# EAGLE design arduino_Shield_ABZ_Decoder_V01 (EAGLE 6.6.0)
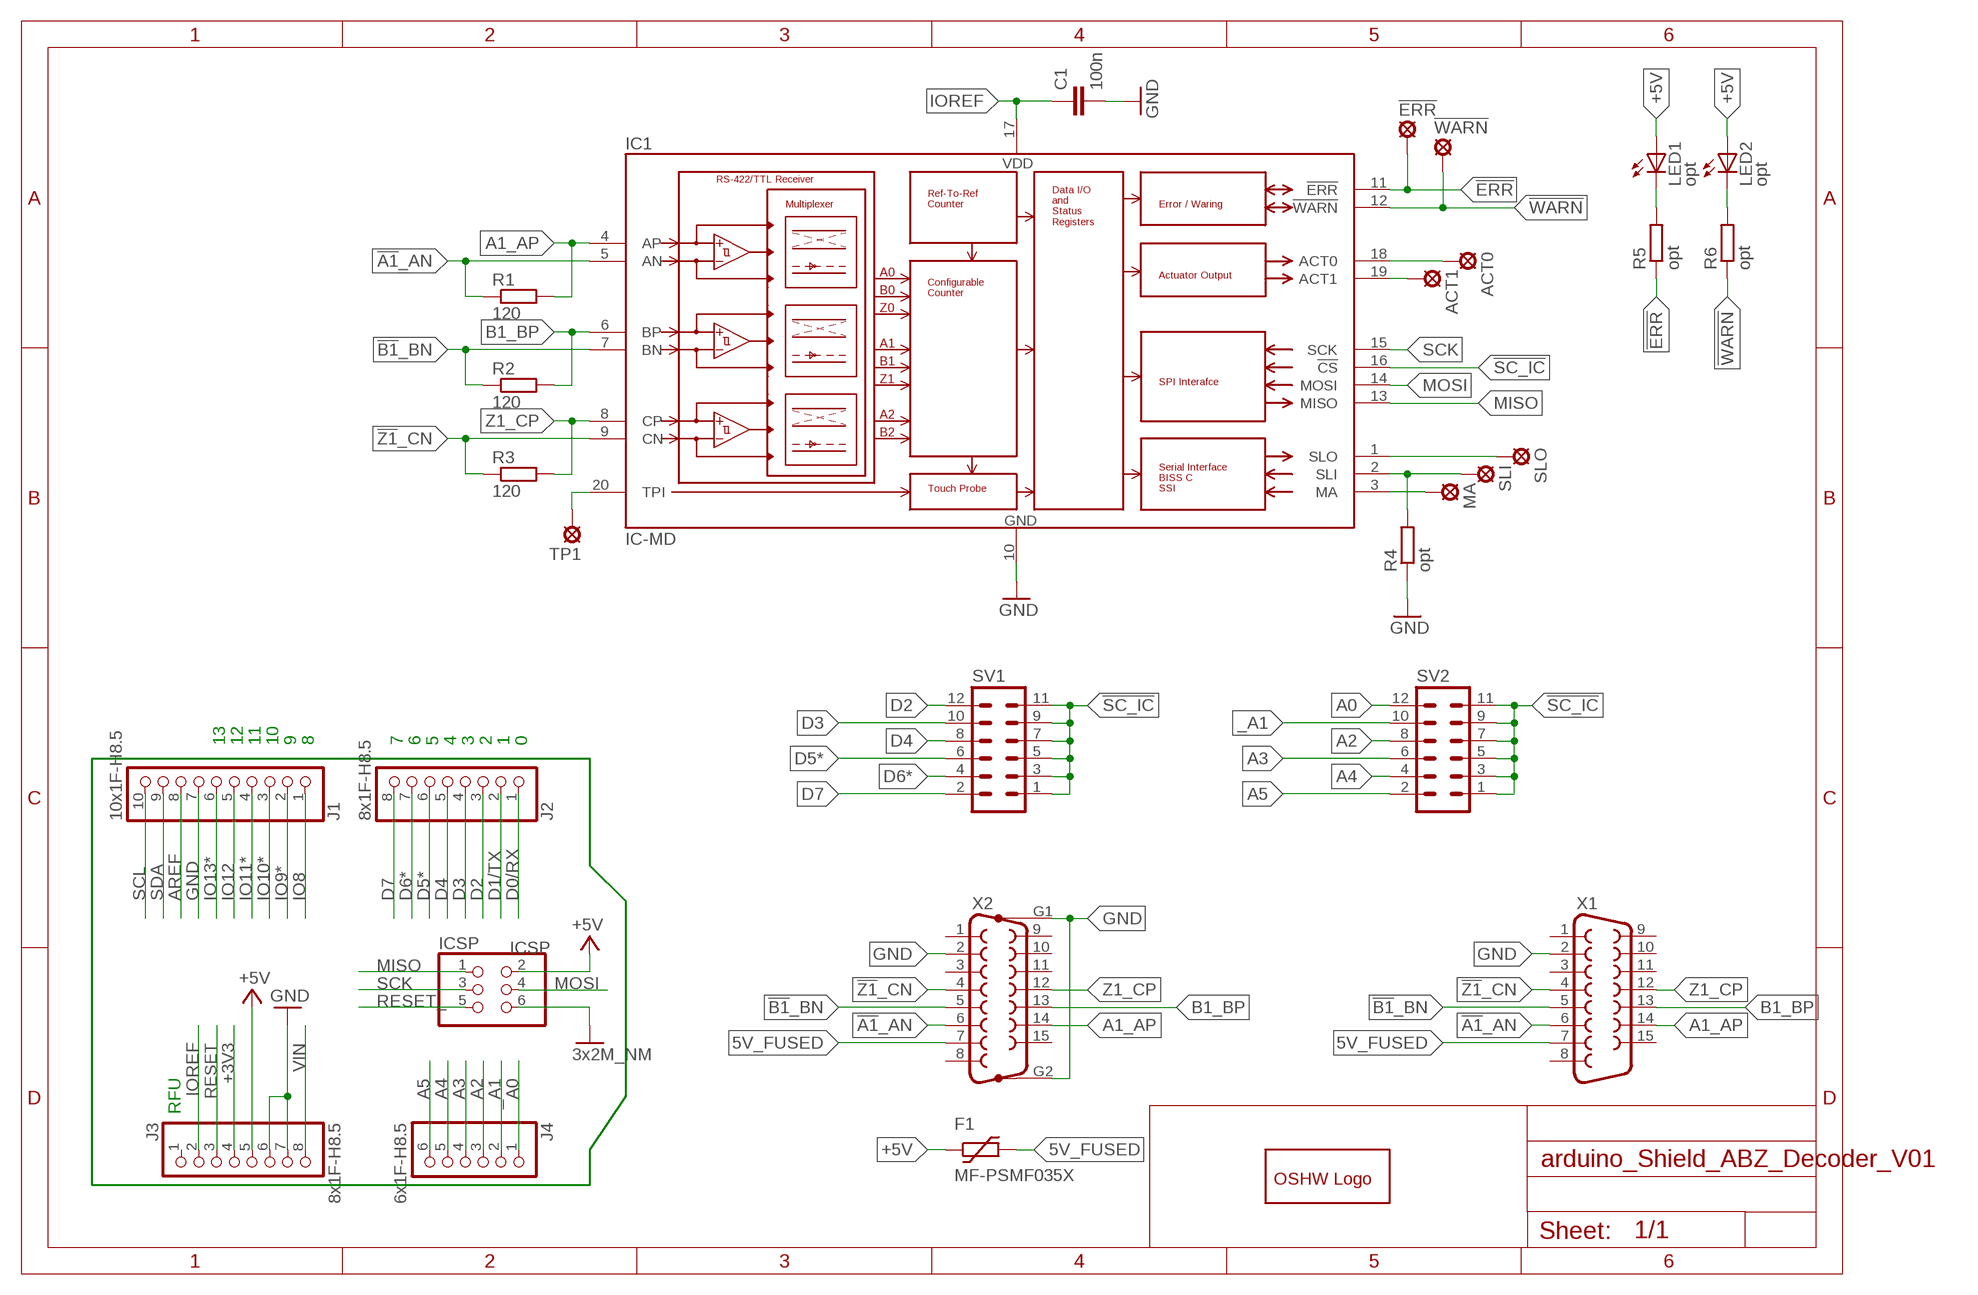
[diagram p0: schematic, sheet 1]

## Parts
!ERR  LSP10  [LSP10]
!WARN  LSP10  [LSP10]
ACT0  LSP10  [LSP10]
ACT1  LSP10  [LSP10]
C1  100n  C-EUC0805  [C0805]
F1  MF-PSMF035X  [F0805]
GOLD_ORB_SM1  OSHWLOGOLOGO8MM  [OSHW_8MM]
IC1  IC-MD  [TSSOP20]
ICSP  ICSP  PINHD-2X3  [2X03]
J1  10x1F-H8.5  PINHD-1X10  [1X10]
J2  8x1F-H8.5  PINHD-1X8  [1X08]
J3  8x1F-H8.5  PINHD-1X8  [1X08]
J4  6x1F-H8.5  PINHD-1X6  [1X06]
LED1  opt  LED3MM  [LED3MM]
LED2  opt  LED3MM  [LED3MM]
MA  LSP10  [LSP10]
R1  120  R-EU_M1206  [M1206]
R2  120  R-EU_M1206  [M1206]
R3  120  R-EU_M1206  [M1206]
R4  opt  R-EU_M1206  [M1206]
R5  opt  R-EU_M1206  [M1206]
R6  opt  R-EU_M1206  [M1206]
SLI  LSP10  [LSP10]
SLO  LSP10  [LSP10]
SV1  MA06-2  [MA06-2]
SV2  MA06-2  [MA06-2]
TP1  LSP10  [LSP10]
X1  F15D  [F15D]
X2  F15HP  [F15HP]

## Nets
5V_FUSED: F1.2 X1.7 X2.7
!A1!_AN: IC1.5(AN) R1.1 X1.6 X2.6
!B1!_BN: IC1.7(BN) R2.1 X1.5 X2.5
!ERR: !ERR.MP IC1.11(!ERR) R5.1
!SC_IC: IC1.16(!CS) SV1.1 SV1.3 SV1.5 SV1.7 SV1.9 SV1.11 SV2.1 SV2.3 SV2.5 SV2.7 SV2.9 SV2.11
!WARN: !WARN.MP IC1.12(!WARN) R6.1
!Z1!_CN: IC1.9(CN) R3.1 X1.4 X2.4
+3V3: J3.4
+5V [usbvcc]: F1.1 ICSP.2 J3.5 LED1.A LED2.A
_A1: J4.2 SV2.10
A0: J4.1 SV2.12
A1_AP: IC1.4(AP) R1.2 X1.14 X2.14
A2: J4.3 SV2.8
A3: J4.4 SV2.6
A4: J4.5 SV2.4
A5: J4.6 SV2.2
ACT0: ACT0.MP IC1.18(ACT0)
ACT1: ACT1.MP IC1.19(ACT1)
AREF [aref]: J1.8
B1_BP: IC1.6(BP) R2.2 X1.13 X2.13
D0/RX: J2.1
D1/TX: J2.2
D2: J2.3 SV1.12
D3: J2.4 SV1.10
D4: J2.5 SV1.8
D5*: J2.6 SV1.6
D6*: J2.7 SV1.4
D7: J2.8 SV1.2
GND [gnd]: C1.2 IC1.10(GND) ICSP.6 J1.7 J3.6 J3.7 R4.1 X1.2 X2.2 X2.G1 X2.G2 ; supply symbol labelled 3x2M_NM
IO8: J1.1
IO9*: J1.2
IO10*: J1.3
IO11*: J1.4
IO12: J1.5
IO13*: J1.6
IOREF [usbvcc]: C1.1 IC1.17(VDD) J3.2
MA [gnd]: IC1.3(MA) MA.MP
MISO: IC1.13(MISO) ICSP.1
MOSI: IC1.14(MOSI) ICSP.4
N$14: LED1.K(C) R5.2
N$15: LED2.K(C) R6.2
RESET: J3.3
RESET_: ICSP.5
SCK: IC1.15(SCK) ICSP.3
SCL: J1.10
SDA: J1.9
SLI [gnd]: IC1.2(SLI) R4.2 SLI.MP
SLO: IC1.1(SLO) SLO.MP
TP1: IC1.20(TPI) TP1.MP
VIN [power]: J3.8
Z1_CP: IC1.8(CP) R3.2 X1.12 X2.12
Unconnected: J3.1 X1.1 X1.3 X1.8 X1.9 X1.10 X1.11 X1.15 X2.1 X2.3 X2.8 X2.9 X2.10 X2.11 X2.15

## Notes on the sheet
- 13 | 12 | 11 | 10 | 9 | 8 | 7 | 6 | 5 | 4 | 3 | 2 | 1 | 0
- RFU

## Library data of the parts
!ERR !WARN ACT0 ACT1 MA SLI SLO TP1 = solpad:LSP10: SOLDER PAD drill 1.0 mm, distributor Buerklin, 12H555
C1 = rcl:C-EU: CAPACITOR, European symbol
F1 = Fuses:MF-PSMF*X: BOURNS MF-PSMF???X-2 MULTISICHERUNG, SMD, 0805; I_HOLD: 0,35A; I_TRIP: 0,75A; MANUFACTOR: Bourns; MPN: MF-PSMF035X; OC_FARNELL: 1294875; OPERATING_TEMPERATURE: -40 °C to +85 °C; PART_IDENTIFICATION: 3; V_MAX: 6V
GOLD_ORB_SM1 = oshw:OSHWLOGO: The OSHW logo for PCB layout
IC1 = IC-MD:IC-MD: iC-MD 48-Bit Quadrature Counter with RS422 Receiver and SPI/BiSS Interface Counter resolutions: 16, 24, 32 and 48 bit Up to 3 AB/ABZ quadrature counters configurable High count frequency of up to 40 MHz Pin triggered touch probe function Evaluation of distance-coded reference marks Cascading/bus capable via SPI and BiSS C Interface RS422, TTL, CMOS, LVDS input signals Operating temperature -40 °C to +125 °C, small TSSOP package 1 Channel 16, 24, 32 or 48 bit counting for quadrature signals with index (TTL, diff. RS422 or LVDS) Default: 1x A/B/Z, RS422, 24 bit 2 Channel 16/24 bit, or 16/32 bit counting (2x single-ended TTL with index: A/B/Z) 3 Channel 16 bit counting (3x single-ended TTL: A/B) Two actuator output signals Operation from 3.3 V to 5 V Homepage: http://ichaus.de/MD Datenblatt: http://ichaus.de/MD_datasheet_en; MANUFACTURER: IC-Haus; MPN: iC-MD TSSOP20; OC_ICHAUS: iC-MD TSSOP20
ICSP = SmartPrj:PINHD-2X3: PIN HEADER
J1 = SmartPrj:PINHD-1X10: PIN HEADER
J2 J3 = SmartPrj:PINHD-1X8: PIN HEADER
J4 = SmartPrj:PINHD-1X6: PIN HEADER
LED1 LED2 = led:LED: LED OSRAM: - CHIPLED LG R971, LG N971, LY N971, LG Q971, LY Q971, LO R971, LY R971 LH N974, LH R974 LS Q976, LO Q976, LY Q976 LO Q996 - Hyper CHIPLED LW Q18S LB Q993, LB Q99A, LB R99A - SideLED LS A670, LO A670, LY A670, LG A670, LP A670 LB A673, LV A673, LT A673, LW A673 LH A674 LY A675 LS A676, LA A676, LO A676, LY A676, LW A676 LS A679, LY A679, LG A679 - Hyper Micro SIDELED® LS Y876, LA Y876, LO Y876, LY Y876 LT Y87S - SmartLED LW L88C, LW L88S LB L89C, LB L89S, LG L890 LS L89K, LO L89K, LY L89K LS L896, LA L896, LO L896, LY L896 - TOPLED LS T670, LO T670, LY T670, LG T670, LP T670 LSG T670, LSP T670, LSY T670, LOP T670, LYG T670 LG T671, LOG T671, LSG T671 LB T673, LV T673, LT T673, LW T673 LH T674 LS T676, LA T676, LO T676, LY T676, LB T676, LH T676, LSB T676, LW T676 LB T67C, LV T67C, LT T67C, LS T67K, LO T67K, LY T67K, LW E67C LS E67B, LA E67B, LO E67B, LY E67B, LB E67C, LV E67C, LT E67C LW T67C LS T679, LY T679, LG T679 LS T770, LO T770, LY T770, LG T770, LP T770 LB T773, LV T773, LT T773, LW T773 LH T774 LS E675, LA E675, LY E675, LS T675 LS T776, LA T776, LO T776, LY T776, LB T776 LHGB T686 LT T68C, LB T68C - Hyper Mini TOPLED® LB M676 - Mini TOPLED Santana® LG M470 LS M47K, LO M47K, LY M47K Source: http://www.osram.convergy.de LUXEON: - LUMILED® LXK2-PW12-R00, LXK2-PW12-S00, LXK2-PW14-U00, LXK2-PW14-V00 LXK2-PM12-R00, LXK2-PM12-S00, LXK2-PM14-U00 LXK2-PE12-Q00, LXK2-PE12-R00, LXK2-PE12-S00, LXK2-PE14-T00, LXK2-PE14-U00 LXK2-PB12-K00, LXK2-PB12-L00, LXK2-PB12-M00, LXK2-PB14-N00, LXK2-PB14-P00, LXK2-PB14-Q00 LXK2-PR12-L00, LXK2-PR12-M00, LXK2-PR14-Q00, LXK2-PR14-R00 LXK2-PD12-Q00, LXK2-PD12-R00, LXK2-PD12-S00 LXK2-PH12-R00, LXK2-PH12-S00 LXK2-PL12-P00, LXK2-PL12-Q00, LXK2-PL12-R00 Source: www.luxeon.com KINGBRIGHT: KA-3528ASYC Source: www.kingbright.com
R1-R6 = rcl:R-EU_: RESISTOR, European symbol
SV1 SV2 = con-lstb:MA06-2: PIN HEADER; OC_FARNELL: unknown; OC_NEWARK: unknown
X1 = con-subd:F15: SUB-D; OC_FARNELL: unknown; OC_NEWARK: unknown
X2 = con-subd:F15HP: SUB-D; OC_FARNELL: unknown; OC_NEWARK: unknown

## Net classes
0 default: width 0.254 mm, drill 0.61 mm, clearance 0.254 mm
1 power: width 0.254 mm, drill 0.61 mm, clearance 0.254 mm
2 gnd: width 0.254 mm, drill 0.61 mm, clearance 0.254 mm
3 usbvcc: width 0.254 mm, drill 0.61 mm, clearance 0.254 mm
4 aref: width 0.254 mm, drill 0.61 mm, clearance 0.254 mm

## Board
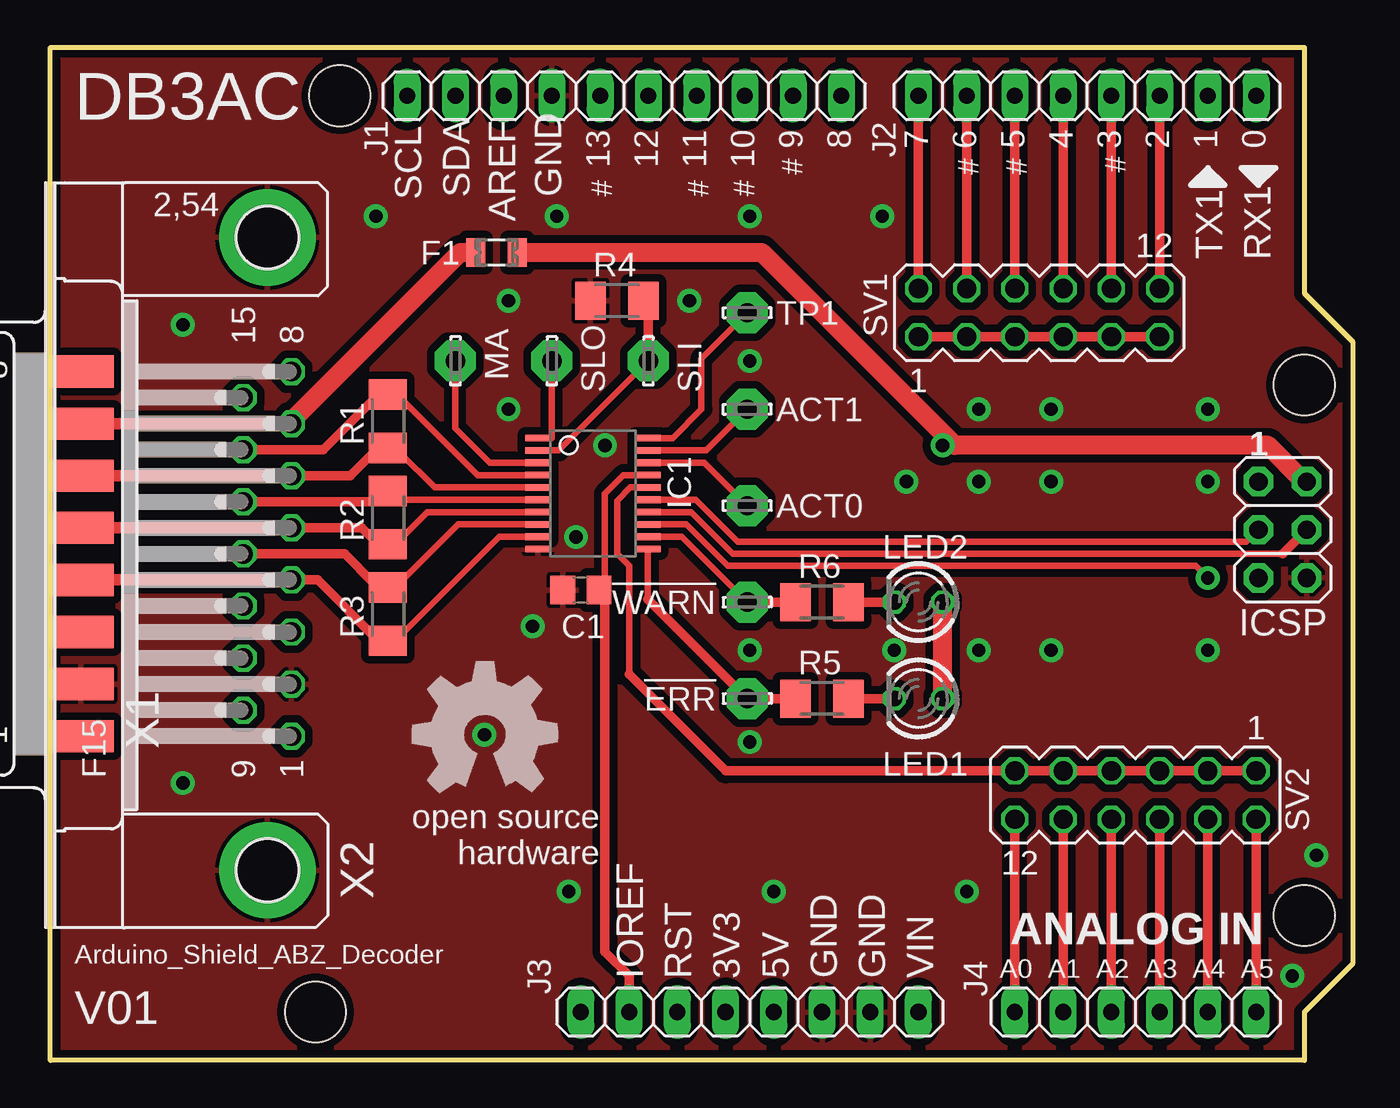
[diagram p1: board, top side]
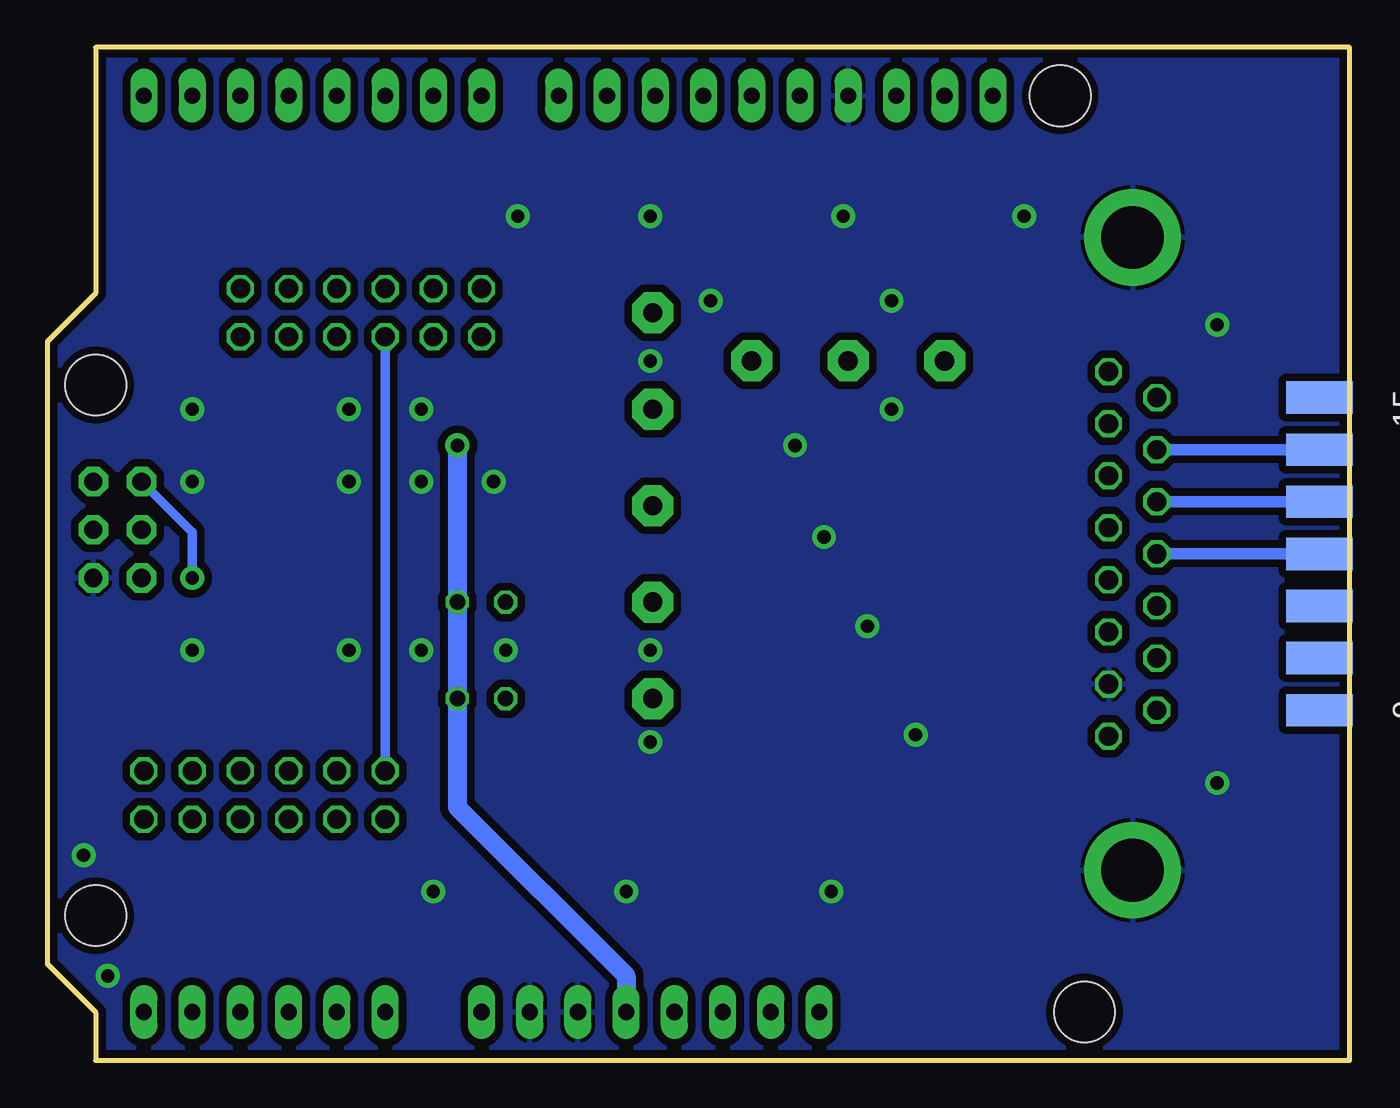
[diagram p2: board, bottom side, seen from below]

Size 68.58 x 53.34 mm. Coordinates in mm from the lower left corner, seen from the top.
Outline: 0,53.34 66.04,53.34 66.04,40.39 68.58,37.85 68.58,5.08 66.04,2.54 66.04,0 0,0 0,53.34
Copper layers (1*16): Top 0.035mm / dielectric 1.5mm / Bottom 0.035mm
Design rules "PCB-POOL Standard": minimum track width 0.15mm, minimum drill 0.3mm, track to track 0.15mm, track to pad 0.15mm, pad to pad 0.15mm, via to via 0.15mm, smd to smd 0.15mm, copper to edge 0.3mm, drill to drill 0.2mm, minimum pad ring 0.2mm, minimum via ring 0.15mm, stop-mask expansion 0.075mm, vias tented up to drill 0mil, thermal gap 0.2mm
Holes 3.2 mm at 66.04,35.56 66.04,7.62 15.24,50.8 13.97,2.54

### Footprints (pad centres in the part's own frame; a part is rotated, then mirrored left to right if it is on the bottom)
LSP10 = drill 1.016 pad 2.159 octagon: MP 0,0
C0805 = smd 1.3 x 1.5: 1 -0.95,0; 2 0.95,0
F0805 = smd 1 x 1.5: 1 -1.1,0; 2 1.1,0
TSSOP20 = smd 0.35 x 1.35: 1 -2.925,-2.9; 2 -2.275,-2.9; 3 -1.625,-2.9; 4 -0.975,-2.9; 5 -0.325,-2.9; 6 0.325,-2.9; 7 0.975,-2.9; 8 1.625,-2.9; 9 2.275,-2.9; 10 2.925,-2.9; 11 2.925,2.9; 12 2.275,2.9; 13 1.625,2.9; 14 0.975,2.9; 15 0.325,2.9; 16 -0.325,2.9; 17 -0.975,2.9; 18 -1.625,2.9; 19 -2.275,2.9; 20 -2.925,2.9
2X03 = drill 0.95 pad 1.55 octagon: 1 -2.54,-1.27; 2 -2.54,1.27; 3 0,-1.27; 4 0,1.27; 5 2.54,-1.27; 6 2.54,1.27
1X10 = drill 0.85 pad 1.422 long: 1 -11.43,0; 2 -8.89,0; 3 -6.35,0; 4 -3.81,0; 5 -1.27,0; 6 1.27,0; 7 3.81,0; 8 6.35,0; 9 8.89,0; 10 11.43,0
1X08 = drill 0.85 pad 1.422 long: 1 -8.89,0; 2 -6.35,0; 3 -3.81,0; 4 -1.27,0; 5 1.27,0; 6 3.81,0; 7 6.35,0; 8 8.89,0
1X06 = drill 0.85 pad 1.422 long: 1 -6.35,0; 2 -3.81,0; 3 -1.27,0; 4 1.27,0; 5 3.81,0; 6 6.35,0
LED3MM = drill 0.813 octagon: A -1.27,0; K 1.27,0
M1206 = smd 1.6 x 2: 1 -1.4,0; 2 1.4,0
MA06-2 = drill 1.016 octagon: 1 -6.35,-1.27; 2 -6.35,1.27; 3 -3.81,-1.27; 4 -3.81,1.27; 5 -1.27,-1.27; 6 -1.27,1.27; 7 1.27,-1.27; 8 1.27,1.27; 9 3.81,-1.27; 10 3.81,1.27; 11 6.35,-1.27; 12 6.35,1.27
F15D = smd 1.7 x 3.5: 1 -9.601,-6.045; 2 -6.858,-6.045; 3 -4.115,-6.045; 4 -1.372,-6.045; 5 1.372,-6.045; 6 4.115,-6.045; 7 6.858,-6.045; 8 9.601,-6.045 | smd 1.7 x 3.5 bottom: 9 -8.23,-6.045; 10 -5.486,-6.045; 11 -2.743,-6.045; 12 0,-6.045; 13 2.743,-6.045; 14 5.486,-6.045; 15 8.23,-6.045
F15HP = drill 1.016 octagon: 1 -9.601,-1.27; 2 -6.858,-1.27; 3 -4.115,-1.27; 4 -1.372,-1.27; 5 1.372,-1.27; 6 4.115,-1.27; 7 6.858,-1.27; 8 9.601,-1.27; 9 -8.23,1.27; 10 -5.486,1.27; 11 -2.743,1.27; 12 0,1.27; 13 2.743,1.27; 14 5.486,1.27; 15 8.23,1.27 | drill 3.302 pad 5.08: G1 -16.662,0; G2 16.662,0

### Placement (x,y rotation side)
!ERR  36.7,19.05 0 top
!WARN  36.7,24.13 0 top
ACT0  36.7,29.21 180 top
ACT1  36.7,34.29 180 top
C1  27.94,24.77 180 top
F1  23.5,42.55 180 top
GOLD_ORB_SM1  22.86,17.14 0 top
IC1  28.57,29.84 270 top
ICSP  64.9,27.94 270 top
J1  30.23,50.8 180 top
J2  54.61,50.8 180 top
J3  36.83,2.54 0 top
J4  57.15,2.54 0 top
LED1  45.72,19.05 180 top
LED2  45.72,24.13 180 top
MA  21.34,36.83 270 top
R1  17.78,33.66 90 top
R2  17.78,28.57 90 top
R3  17.78,23.5 90 top
R4  29.84,40.01 0 top
R5  40.64,19.05 0 top
R6  40.64,24.13 0 top
SLI  31.5,36.83 270 top
SLO  26.42,36.83 270 top
SV1  52.07,39.37 0 top
SV2  57.15,13.97 180 top
TP1  36.7,39.37 180 top
X1  -4.45,26.67 90 top
X2  11.43,26.67 90 top

### Tracks (layer width: path | path; a pad name or v marks a point on that pad's centre or on a via)
5V_FUSED
  Top 0.6: X1.7 X2.7
  Top 1: X2.7 12.7,33.66 21.59,42.55 F1.2
!A1!_AN
  Top 0.35: IC1.5 20.25,30.17 18.41,32 18.03,32 R1.1
  Top 0.5: X2.6 15.8,30.79 17.27,32.26 R1.1
  Top 0.6: X1.6 X2.6
  Top 0.75: X2.6
!B1!_BN
  Top 0.35: IC1.7 19.85,28.87 18.29,27.3 17.91,27.3 R2.1
  Top 0.5: X2.5 16.41,28.04 17.14,27.3 17.65,27.3 R2.1
  Top 0.6: X1.5 X2.5
  Top 0.75: X2.5
!ERR
  Top 0.35: IC1.11 31.48,24.28
  Top 0.5: R5.1 !ERR.MP 31.48,24.28
!SC_IC
  Top 0.35: IC1.16 30.55,30.17 29.84,29.46 29.84,26.67 30.48,26.04 30.48,20.32
  Top 0.5: SV2.1 SV2.3 SV2.5 SV2.7 SV2.9 SV2.11 35.56,15.24 30.48,20.32 | SV1.1 SV1.3 SV1.5 SV1.7 SV1.9 SV1.11
  Bottom 0.5: SV2.11 SV1.5
!WARN
  Top 0.35: IC1.12 33.26,27.57 !WARN.MP
  Top 0.5: R6.1 !WARN.MP
!Z1!_CN
  Top 0.35: IC1.9 23.63,27.57 18.29,22.23 17.91,22.23 R3.1
  Top 0.5: X2.4 14.07,25.3 17.27,22.1 R3.1
  Top 0.6: X1.4 X2.4
  Top 0.75: X2.4
+5V  (via drill 0.7)
  Top 0.35: 47.62,32.38 v46.99,32.38
  Top 1: LED1.A LED2.A | ICSP.2 66.04,30.48 64.14,32.38 47.62,32.38 37.47,42.55 F1.1
  Bottom 1: v46.99,32.38 LED1.A 46.99,17.14 46.99,13.34 38.1,4.45 J3.5
_A1
  Top 0.5: J4.2 SV2.10
A0
  Top 0.5: J4.1 SV2.12
A1_AP
  Top 0.35: IC1.4 22.52,30.82 18.54,34.8 18.04,34.8 R1.2
  Top 0.5: X2.14 14.38,32.16 17.27,35.05 R1.2
  Bottom 0.6: X1.14 X2.14
A2
  Top 0.5: J4.3 SV2.8
A3
  Top 0.5: J4.4 SV2.6
A4
  Top 0.5: J4.5 SV2.4
A5
  Top 0.5: J4.6 SV2.2
ACT0
  Top 0.35: IC1.18 34.44,31.47 ACT0.MP
ACT1
  Top 0.35: IC1.19 34.53,32.12 ACT1.MP
B1_BP
  Top 0.35: IC1.6 18.23,29.52 R2.2
  Top 0.5: X2.13 17.22,29.41 R2.2
  Bottom 0.6: X1.13 X2.13
D2
  Top 0.5: J2.3 SV1.12
D3
  Top 0.5: J2.4 SV1.10
D4
  Top 0.5: J2.5 SV1.8
D5*
  Top 0.5: J2.6 SV1.6
D6*
  Top 0.5: J2.7 SV1.4
D7
  Top 0.5: SV1.2 J2.8
GND  (via drill 0.7)
  other vias: 25.4,22.86 36.83,21.59 60.96,30.48 29.21,32.38 27.69,27.56 24.13,34.29 24.13,40.01 33.66,40.01 36.83,36.83 36.83,44.45 36.83,16.76 38.1,8.89 22.86,17.14 60.96,34.29 60.96,21.59 52.7,30.48 48.9,30.48 45.09,30.48 52.7,21.59 48.9,21.59 44.45,21.59 52.7,34.29 48.9,34.29 43.81,44.45 26.67,44.45 17.14,44.45 66.67,10.79 65.41,4.45 48.26,8.89 27.3,8.89 6.99,38.73 6.99,14.61
  pour Bottom (isolate 0.406, rank 2): 0,53.34 68.58,53.34 68.58,0 1.64,0 arc-90 0,1.64
  pour Top (isolate 0.406, rank 2): 0,53.34 68.58,53.34 68.58,0 0,0
IOREF
  Top 0.35: IC1.17 30.18,30.82 29.21,29.84 29.21,25.09 C1.1 28.89,24.45 29.21,24.13
  Top 0.5: 29.21,24.13 29.21,5.71 30.48,4.45 J3.2
MA
  Top 0.35: IC1.3 23.14,31.47 21.34,33.27 MA.MP
MISO  (via drill 0.7)
  Top 0.35: IC1.13 33.5,28.22 35.69,26.04 60.33,26.04 v60.96,25.4
  Bottom 0.5: v60.96,25.4 60.96,27.81 ICSP.1
MOSI
  Top 0.35: IC1.14 33.74,28.87 35.94,26.67 64.9,26.67
  Top 0.5: 64.9,26.67 ICSP.4
N$14
  Top 0.5: LED1.K R5.2
N$15
  Top 0.5: LED2.K R6.2
SCK
  Top 0.35: IC1.15 33.98,29.52 36.2,27.3 62.99,27.3 ICSP.3
SLI
  Top 0.35: IC1.2 26.79,32.12 SLI.MP | 31.5,39.75 R4.2
  Top 0.5: SLI.MP 31.5,39.75
SLO
  Top 0.35: IC1.1 26.42,32.77 SLO.MP
TP1
  Top 0.35: IC1.20 32.77,32.77 34.29,34.29 34.29,36.96 TP1.MP
Z1_CP
  Top 0.35: IC1.8 21.49,28.22 18.54,25.27 18.16,25.27 R3.2
  Top 0.5: X2.12 15.49,26.67 17.02,25.15 17.53,25.15 R3.2
  Bottom 0.6: X1.12 X2.12

### Text on the board
tPlace: DB3AC | 13 | 12 | 11 | 10 | 9 | 8 | 7 | 6 | 5 | 4 | 3 | 2 | 1 | 0 | Arduino_Shield_ABZ_Decoder | V01
tNames: # | # | # | # | SCL | SDA | GND | # | # | # | AREF | TX1 | RX1 | 1 | ANALOG IN | IOREF | RST | 3V3 | 5V | GND | GND | VIN | A0 | A1 | A2 | A3 | A4 | A5